# EAGLE design LoRaAdapter (EAGLE 9.6.2)
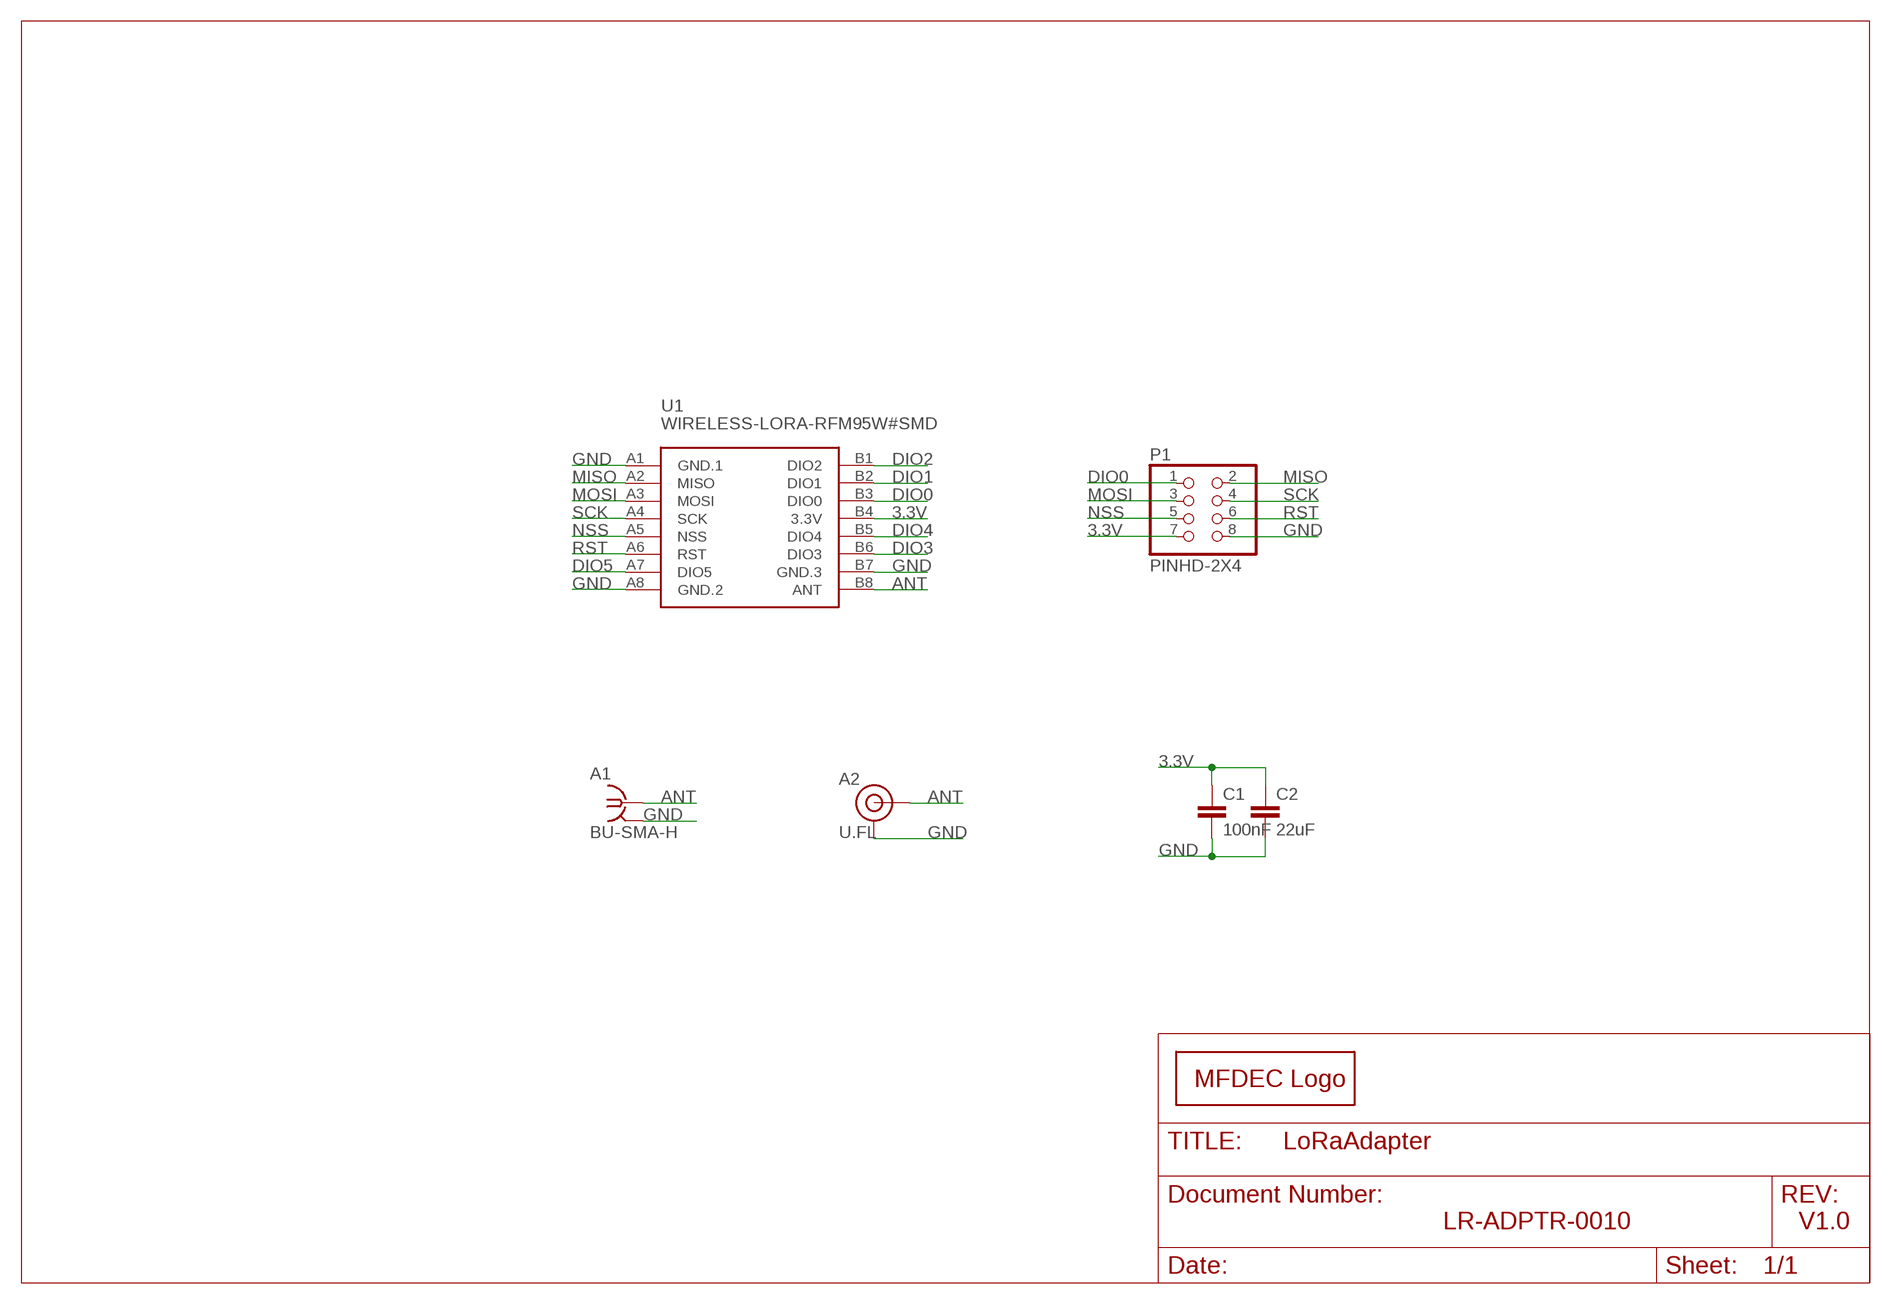
[diagram p0: schematic, sheet 1]

## Parts
A1  BU-SMA-H  [BU-SMA-H]
A2  U.FL  U.FL2PIN  [U.FL]
C1  100nF  C-EUC0603  [C0603]
C2  22uF  C-EUC1206  [C1206]
LOGO1  MFDECLOGO_SQ_5MM  [MFDEC_SQ_5MM]
P1  PINHD-2X4  [2X04]
U1  WIRELESS-LORA-RFM95W#SMD  [WIRELESS-LORA-RFM95W#SMD]

## Nets
3.3V: C1.1 C2.1 P1.7 U1.B4(3.3V)
ANT: A1.1 A2.FEED(SIGNAL) U1.B8(ANT)
DIO0: P1.1 U1.B3(DIO0)
DIO1: U1.B2(DIO1)
DIO2: U1.B1(DIO2)
DIO3: U1.B6(DIO3)
DIO4: U1.B5(DIO4)
DIO5: U1.A7(DIO5)
GND: A1.2 A1.3 A1.4 A1.5 A2.1(GND) A2.2(GND) C1.2 C2.2 P1.8 U1.A1(GND.1) U1.A8(GND.2) U1.B7(GND.3)
MISO: P1.2 U1.A2(MISO)
MOSI: P1.3 U1.A3(MOSI)
NSS: P1.5 U1.A5(NSS)
RST: P1.6 U1.A6(RST)
SCK: P1.4 U1.A4(SCK)

## Notes on the sheet
- LR-ADPTR-0010 | V1.0

## Library data of the parts
A1 = con-coax:BU-SMA-H: FEMALE SMA CONNECTOR Radiall; OC_FARNELL: unknown; OC_NEWARK: unknown
A2 = SparkFun-Connectors:U.FL2PIN: SMD Antenna Connector - U.FL 2mm height, 3.0mm x 3.0mm receptacle size. SparkFun Products: SparkFun WiFi Shield - ESP8266 <https://www.sparkfun.com/products/13287> SparkFun ESP8266 Thing <https://www.sparkfun.com/products/13231> SparkFun MiniGen - Pro Mini Signal Generator Shield <https://www.sparkfun.com/products/11420>; PROD_ID: CONN-09193; SF_ID: WRL-09144
C1 C2 = rcl:C-EU: CAPACITOR, European symbol; SPICEPREFIX: C
LOGO1 = _my_logos:MFDECLOGO: Midnight Fog - Digital Eye Candy LOGO
P1 = Connector:PINHD-2X4: PIN HEADER; CATEGORY: CONNECTOR; SUB-CATEGORY: PIN-HEADER
U1 = diy-modules:WIRELESS-LORA-RFM95W: 868/915 MHz LoRa Radio Transceiver Module based on SX1276 chip Click here to find device on ebay.com <http://www.ebay.com/sch/RFM95W+transceiver>

## Board
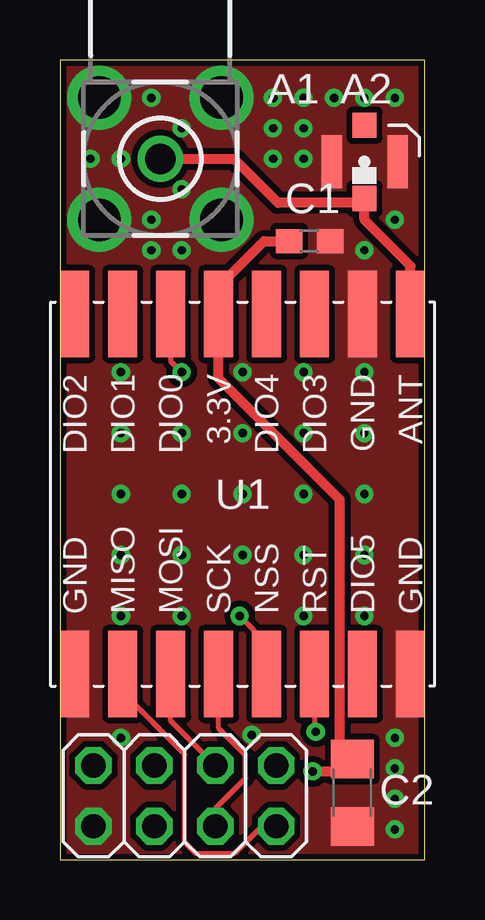
[diagram p1: board, top side]
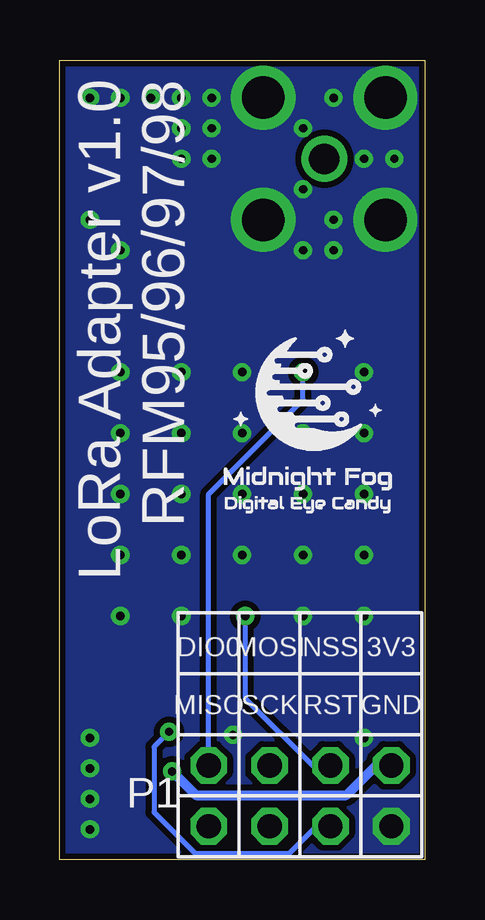
[diagram p2: board, bottom side, seen from below]

Size 15.22 x 33.33 mm. Coordinates in mm from the lower left corner, seen from the top.
Outline: 0,0 15.22,0 15.22,33.33 0,33.33 0,0
Copper layers (1*16): Top 0.035mm / dielectric 1.5mm / Bottom 0.035mm
Design rules "default *": minimum track width 6mil, minimum drill 0.35mm, track to track 6mil, track to pad 6mil, pad to pad 6mil, via to via 6mil, smd to smd 6mil, copper to edge 5mil, drill to drill 6mil, minimum pad ring 10mil, minimum via ring 8mil, stop-mask expansion 4mil, vias tented up to drill 16mil, thermal gap 10mil

### Footprints (pad centres in the part's own frame; a part is rotated, then mirrored left to right if it is on the bottom)
BU-SMA-H = drill 1.27: 1 0,0 | drill 1.778: 2 -2.55,2.55; 3 2.55,2.55; 4 2.55,-2.55; 5 -2.55,-2.55
U.FL = smd 2.2 x 0.85: 1 0,1.375; 2 0,-1.375 | smd 1.05 x 1: FEED 1.525,0; NC -1.525,0
C0603 = smd 1.1 x 1: 1 -0.85,0; 2 0.85,0
C1206 = smd 1.6 x 1.8: 1 -1.4,0; 2 1.4,0
2X04 = drill 1.016 octagon: 1 -3.81,-1.27; 2 -3.81,1.27; 3 -1.27,-1.27; 4 -1.27,1.27; 5 1.27,-1.27; 6 1.27,1.27; 7 3.81,-1.27; 8 3.81,1.27
WIRELESS-LORA-RFM95W#SMD = smd 3.6 x 1.2: A1 -7.5,7; A2 -7.5,5; A3 -7.5,3; A4 -7.5,1; A5 -7.5,-1; A6 -7.5,-3; A7 -7.5,-5; A8 -7.5,-7; B1 7.5,7; B2 7.5,5; B3 7.5,3; B4 7.5,1; B5 7.5,-1; B6 7.5,-3; B7 7.5,-5; B8 7.5,-7

### Placement (x,y rotation side)
A1  4.19,29.21 90 top
A2  12.7,29.08 270 top
C1  10.41,25.78 0 top
C2  12.19,2.79 270 top
LOGO1  8.89,14.22 0 bottom
P1  5.21,2.67 180 top
U1  7.62,15.24 90 top

### Tracks (layer width: path | path; a pad name or v marks a point on that pad's centre or on a via)
3.3V  (via drill 0.35)
  Top 0.406: v10.54,3.68 11.55,3.68 12.06,4.19 C2.1 11.66,4.72 11.66,15.02 6.62,20.06 U1.B4 6.62,23.88 8.52,25.78 C1.1
  Bottom 0.406: v10.54,3.68 9.55,2.69 3.28,2.69 2.03,3.94 P1.7
ANT
  Top 0.406: U1.B8 14.62,24.75 12.7,26.67 A2.FEED 12.52,27.37 9.1,27.37 7.26,29.21 A1.1
DIO0  (via drill 0.35)
  Top 0.203: v5.08,20.32 4.62,20.78 U1.B3
  Bottom 0.203: P1.1 9.02,15.24 5.08,19.18 v5.08,20.32
GND  (via drill 0.35)
  other vias: 13.97,1.27 13.97,2.54 13.97,3.81 13.97,5.08 2.54,15.24 5.08,15.24 7.62,15.24 10.16,15.24 12.7,15.24 1.27,29.21 3.81,25.4 5.08,25.4 3.81,31.75 8.89,30.48 10.16,31.75 11.43,31.75 12.7,31.75 13.97,31.75 10.16,29.21 10.16,30.48 8.89,31.75 8.89,29.21 12.7,25.4 2.54,12.7 5.08,12.7 7.62,12.7 10.16,12.7 12.7,12.7 2.54,17.78 5.08,17.78 10.16,17.78 12.7,17.78 7.62,17.78 3.81,26.67 2.54,29.21 5.08,27.94 5.08,30.48 12.7,10.16 12.7,20.32 10.16,20.32 7.62,20.32 2.54,20.32 2.54,10.16 5.08,10.16 10.16,10.16 2.54,5.08 13.97,26.67 8,5.21
  pour Top (isolate 0.254, no thermals): -1.27,-0.51 -1.27,34.67 17.91,34.67 18.41,34.16 18.41,-1.52 18.54,-1.65 -0.13,-1.65
  pour Bottom (isolate 0.254, no thermals): -4.32,-1.02 -4.32,37.97 19.94,37.97 21.46,36.45 21.46,-2.79 21.59,-2.92 -2.41,-2.92
MISO
  Top 0.203: U1.A2 2.62,6.98 5.21,4.39 5.21,0.72 5.67,0.25 7.28,0.25 8.42,1.4 P1.2
MOSI
  Top 0.203: P1.3 4.62,5.79 U1.A3
NSS  (via drill 0.35)
  Top 0.203: v7.49,10.16 8.62,9.03 U1.A5
  Bottom 0.203: v7.49,10.16 7.49,6.73 4.7,3.94 P1.5
RST  (via drill 0.35)
  Top 0.203: U1.A6 10.62,5.38 v10.67,5.33
  Bottom 0.203: P1.6 4.53,1.4 5.67,0.25 9.56,0.25 11.3,1.99 11.3,4.7 v10.67,5.33
SCK
  Top 0.203: P1.4 6.48,2.12 7.75,3.39 7.75,4.36 6.62,5.49 U1.A4

### Text on the board
bPlace: 3V3 | NSS | MOSI | DIO0 | GND | RST | SCK | MISO
bNames: LoRa Adapter v1.0 / RFM95/96/97/98